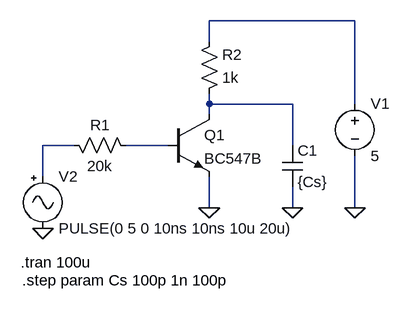
[diagram p0: schematic Lab2_1.asc]
Lab2_1.asc, the LTspice schematic file:
Version 4
SHEET 1 880 680
WIRE 432 -448 208 -448
WIRE 208 -416 208 -448
WIRE 208 -320 208 -336
WIRE 336 -320 208 -320
WIRE 432 -320 432 -448
WIRE 208 -304 208 -320
WIRE 0 -256 -48 -256
WIRE 144 -256 80 -256
WIRE 336 -256 336 -320
WIRE -48 -208 -48 -256
WIRE 208 -160 208 -208
WIRE 336 -160 336 -192
WIRE 432 -160 432 -240
FLAG 208 -160 0
FLAG 336 -160 0
FLAG 432 -160 0
FLAG -48 -128 0
SYMBOL res -16 -272 M90
WINDOW 0 0 56 VBottom 2
WINDOW 3 32 56 VTop 2
SYMATTR InstName R1
SYMATTR Value 20k
SYMBOL res 192 -320 M180
WINDOW 0 36 76 Left 2
WINDOW 3 36 40 Left 2
SYMATTR InstName R2
SYMATTR Value 1k
SYMBOL cap 320 -256 R0
SYMATTR InstName C1
SYMATTR Value {Cs}
SYMBOL voltage 432 -336 R0
WINDOW 123 0 0 Left 0
WINDOW 39 0 0 Left 0
SYMATTR InstName V1
SYMATTR Value 5
SYMBOL npn 144 -304 R0
SYMATTR InstName Q1
SYMATTR Value BC547B
SYMBOL Misc\\signal -48 -224 R0
WINDOW 123 0 0 Left 0
WINDOW 39 0 0 Left 0
SYMATTR InstName V2
SYMATTR Value PULSE(0 5 0 10ns 10ns 10u 20u)
TEXT -82 -76 Left 2 !.tran 100u
TEXT -80 -48 Left 2 !.step param Cs 100p 1n 100p

The netlist it stands for:
* Lab2_1.asc
R1 N003 N004 20k
R2 N002 N001 1k
C1 N002 0 {Cs}
V1 N001 0 5
Q1 N002 N004 0 0 BC547B
V2 N003 0 PULSE(0 5 0 10ns 10ns 10u 20u)
.model NPN NPN
.model PNP PNP
.lib standard.bjt
.tran 100u
.step param Cs 100p 1n 100p
.backanno
.end